# Altium schematic sheet Main heet.SchDoc
size 420 x 297 mm; Address1: Address1; Address2: Address2; Address3: Address3; Address4: Address4; DocumentNumber: АБВГ.123456.001 Э3; SheetNumber: 1; Scale: 1:1; DocumentType: Схема электрическая принципиальная; FirstReferrence: АБВГ.123456.001
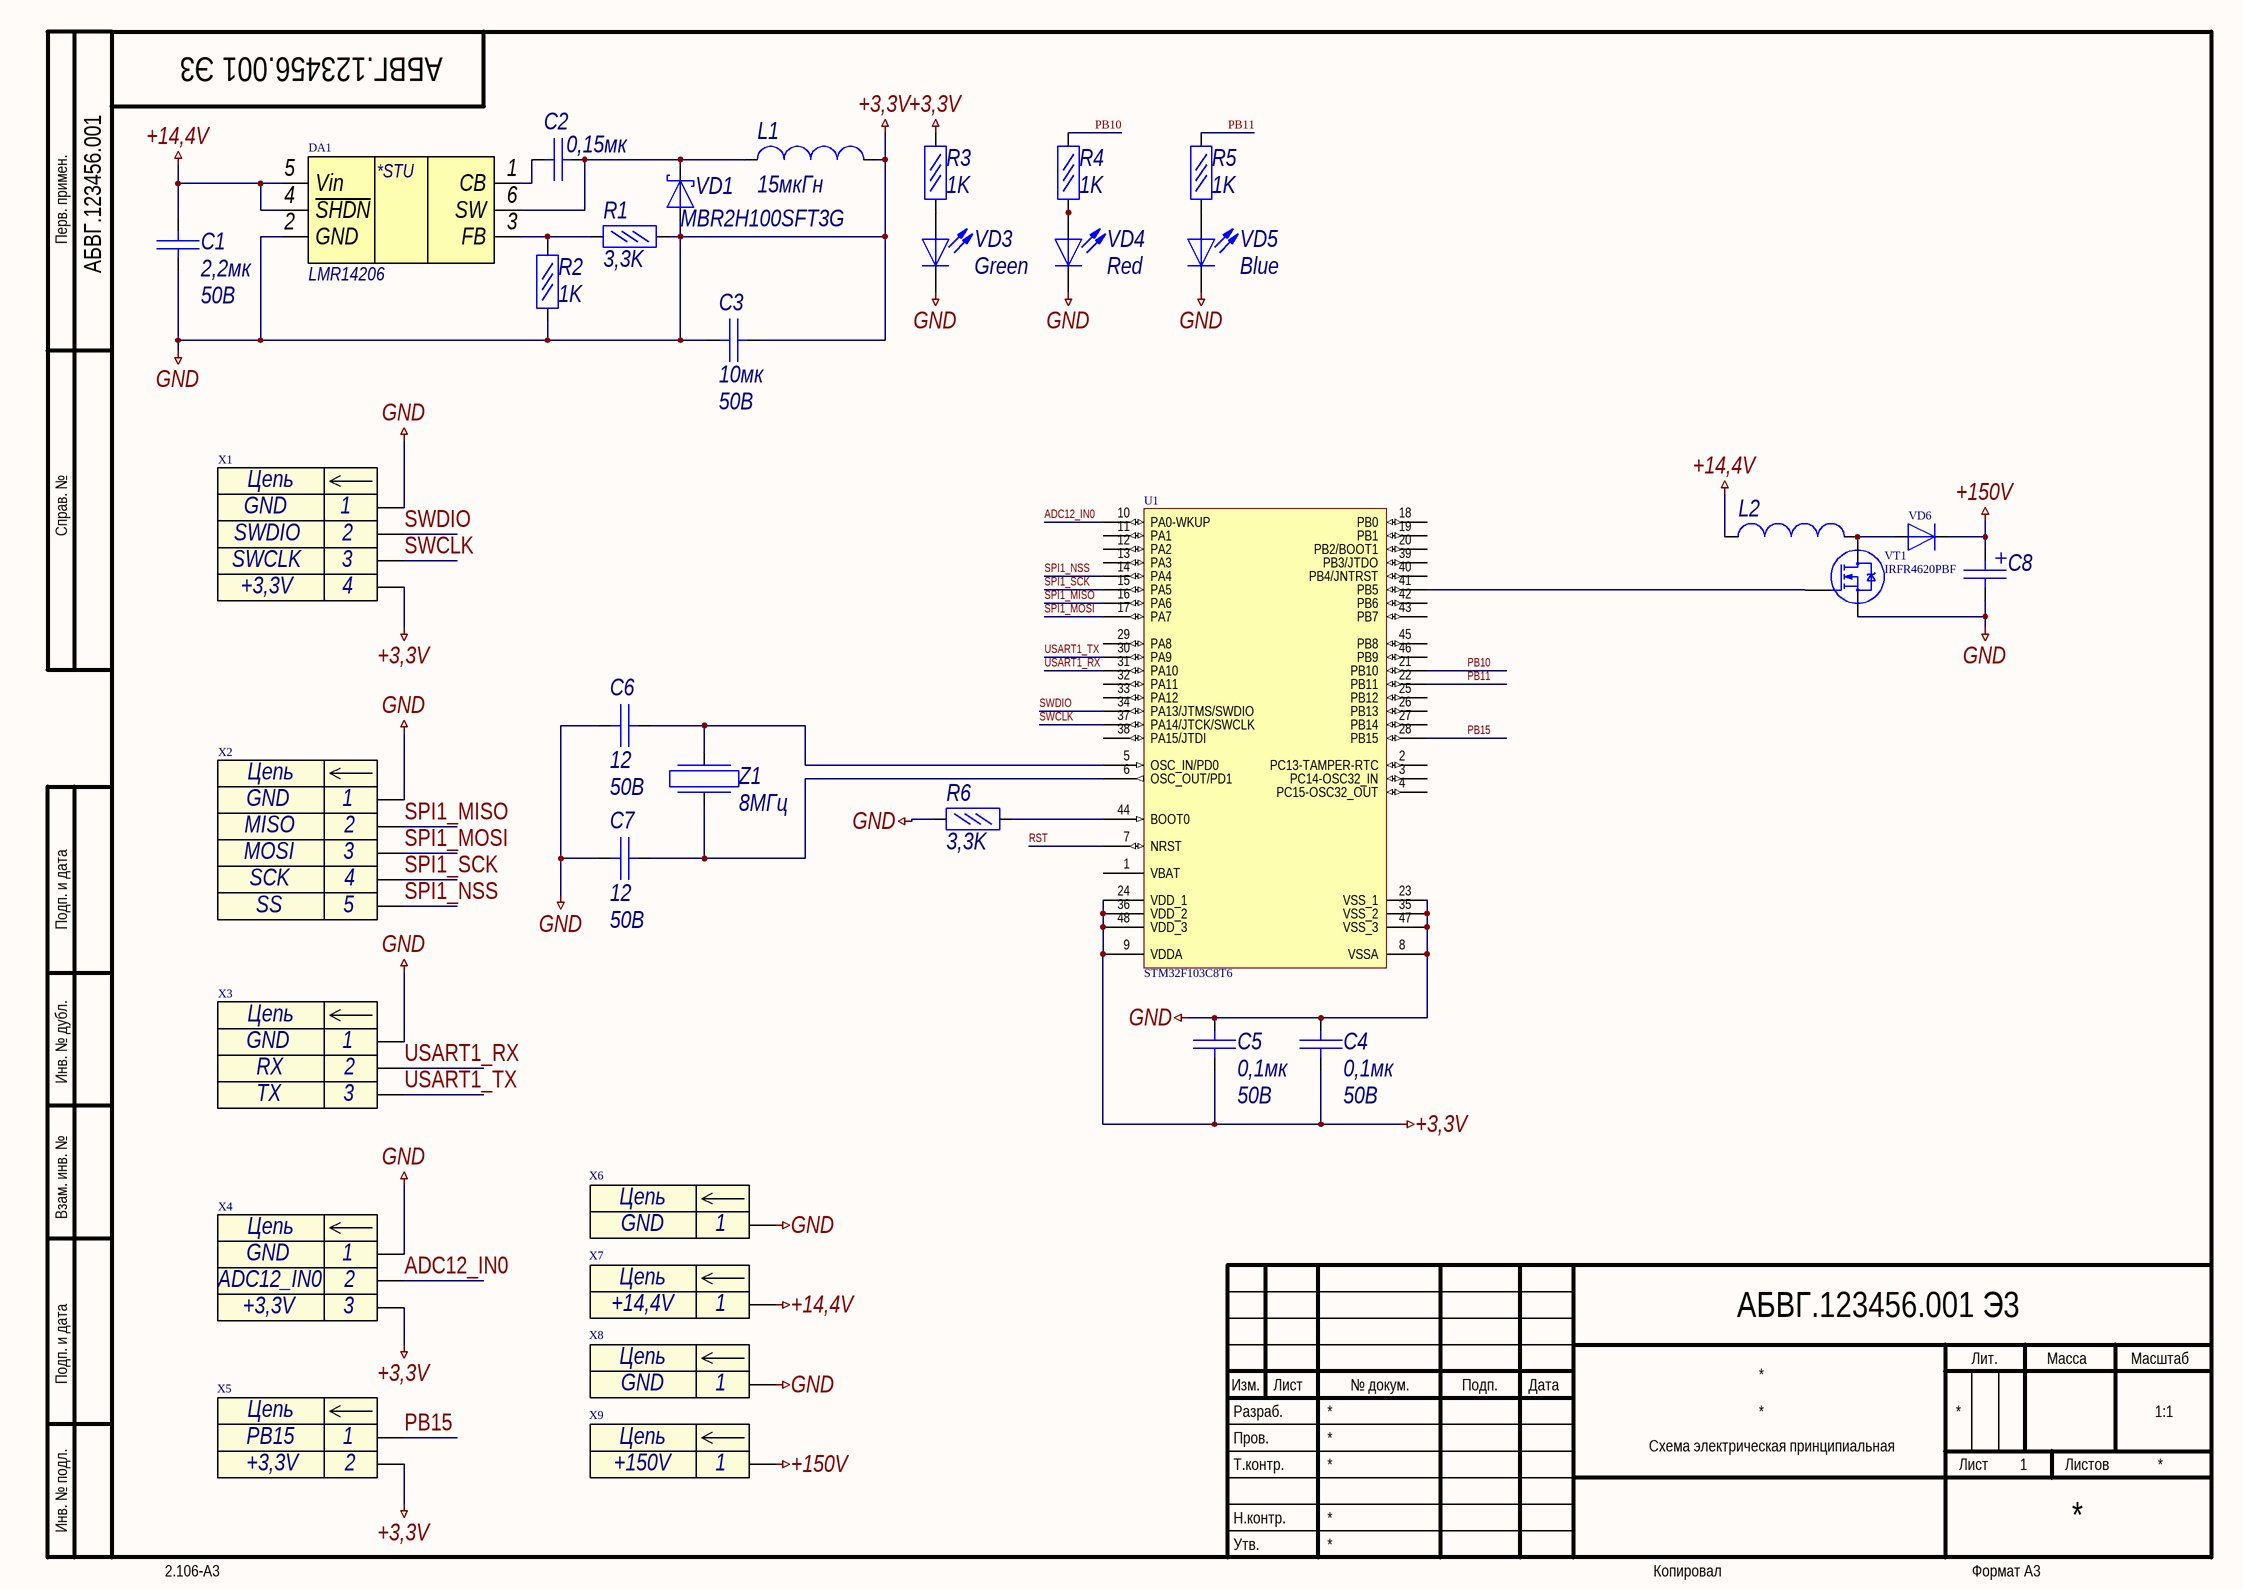
[diagram p0: Main heet.SchDoc]

## Parts
C1  Voltage: 50В  [NPC0805]  (hidden comment: 2,2мк)
C2  0,15мк  [NPC0805]
C3  Voltage: 50В  [NPC0805]  (hidden comment: 10мк)
C4  Voltage: 50В  [NPC0805]  (hidden comment: 0,1мк)
C5  Voltage: 50В  [NPC0805]  (hidden comment: 0,1мк)
C6  Voltage: 50В  [NPC0805]  (hidden comment: 12)
C7  Voltage: 50В  [NPC0805]  (hidden comment: 12)
C8  (no value)  [CAP_PIN_RAD_D16_A7.5]
DA1  LMR14206  [SOT23-6]
L1  15мкГн  [IND: B82472G]
L2  (no value)  [IND: B82477G]
R1  3,3K  [R0603]
R2  1K  [R0603]
R3  1K  [R0603]
R4  1K  [R0603]
R5  1K  [R0603]
R6  3,3K  [R0603]
U1  STM32F103C8T6  [LQFP48]
VD1  MBR2H100SFT3G  [SOD123]
VD3  Green  [0603_LED _GREEN]
VD4  Red  [0603_LED _RED]
VD5  Blue  [0603_LED_BLUE]
VD6  *  [DO-214AA]  (value not drawn)
VT1  IRFR4620PBF  [DPAK]
X1  (no value)  [PLS-4]
X2  (no value)  [PLS-5]
X3  (no value)  [PLS-3]
X4  (no value)  [PLS-3]
X5  (no value)  [PLS-2]
X6  (no value)  [Pad]
X7  (no value)  [Pad]
X8  (no value)  [Pad]
X9  (no value)  [Pad]
Z1  8МГц  [QUARTZ]

## Nets
+3,3V: C1.2 C3.1 C3.2 C4.1 C4.2 C5.1 C5.2 C6.2 C7.2 C8.2 DA1.2(GND) L1.2 R1.1 R2.2 R3.1 R6.2 U1.8(VSSA) U1.9(VDDA) U1.23(VSS_1) U1.24(VDD_1) U1.35(VSS_2) U1.36(VDD_2) U1.47(VSS_3) U1.48(VDD_3) VD1.2(A) VD3.1(K) VD4.1(K) VD5.1(K) VT1.S X1.1 X1.4 X2.1 X3.1 X4.1 X4.3 X5.2 X6.1 X8.1  [also labelled GND]
+14,4V: C1.1 DA1.4(~{SHDN}) DA1.5(Vin) L2.1 X7.1
+150V: C8.1 VD6.1(K) X9.1
ADC12_IN0: U1.10(PA0-WKUP) X4.2
PB10: R4.1 U1.21(PB10)
PB11: R5.1 U1.22(PB11)
PB15: U1.28(PB15) X5.1
RST: U1.7(NRST)
SPI1_MISO: U1.16(PA6) X2.2
SPI1_MOSI: U1.17(PA7) X2.3
SPI1_NSS: U1.14(PA4) X2.5
SPI1_SCK: U1.15(PA5) X2.4
SWCLK: U1.37(PA14/JTCK/SWCLK) X1.3
SWDIO: U1.34(PA13/JTMS/SWDIO) X1.2
USART1_RX: U1.31(PA10) X3.2
USART1_TX: U1.30(PA9) X3.3
NetC2_1: C2.1 DA1.1(CB)
NetC2_2: C2.2 DA1.6(SW) L1.1 VD1.1(K)
NetC6_1: C6.1 U1.5(OSC_IN/PD0) Z1.1
NetC7_1: C7.1 U1.6(OSC_OUT/PD1) Z1.2
NetDA1_3: DA1.3(FB) R1.2 R2.1
NetL2_2: L2.2 VD6.2(A) VT1.D
NetR3_2: R3.2 VD3.2(A)
NetR4_2: R4.2 VD4.2(A)
NetR5_2: R5.2 VD5.2(A)
NetR6_1: R6.1 U1.44(BOOT0)
NetU1_41: U1.41(PB5) VT1.G

Not connected (* = marked no-connect by the designer): U1 1(VBAT) 2(PC13-TAMPER-RTC) 3(PC14-OSC32_IN) 4(PC15-OSC32_OUT) 11(PA1) 12(PA2) 13(PA3) 18(PB0) 19(PB1) 20(PB2/BOOT1) 25(PB12) 26(PB13) 27(PB14) 29(PA8) 32(PA11) 33(PA12) 38(PA15/JTDI) 39(PB3/JTDO) 40(PB4/JNTRST) 42(PB6) 43(PB7) 45(PB8) 46(PB9)

## Notes on the sheet
- Перв. примен.
- Справ. №
- Подп. и дата
- Инв. № дубл.
- Взам. инв. №
- Разраб.
- Изм.
- Лист
- № докум.
- Подп.
- Дата
- Лит.
- Масса
- Масштаб
- Пров.
- Т.контр.
- Листов
- Инв. № подл.
- Утв.
- Н.контр.
- 2.106-A3
- Копировал
- Формат А3
- (in symbol Header_1_plg) Цепь
- (in symbol Header_2_plg) Цепь
- (in symbol Header_3_plg) Цепь
- (in symbol Header_4_plg) Цепь
- (in symbol Header_5_plg) Цепь
- (in symbol LMR14206) *STU

## Library data of the parts
C1 = Capacitor ceramic: Конденсатор кер.; Manufacturer: Yageo; Name: CC0805KKX5R9BB225; Value: 2,2мк; Package: 0805
C2 = Capacitor ceramic: Конденсатор кер.; Manufacturer: Yageo; Name: CC0805KRX7R9BB124; Package: 0805; Value: 0,15мк
C3 = Capacitor ceramic: Конденсатор кер.; Manufacturer: Yageo; Name: CC0805KKX5R8BB106; Value: 10мк; Package: 0805
C4 C5 = Capacitor ceramic: Конденсатор кер.; Manufacturer: Yageo; Name: CC0805JRX7R9BB104; Package: 0805; Value: 0,1мк
C6 C7 = Capacitor ceramic: Конденсатор кер.; Manufacturer: Yageo; Name: CC0805FRNPO9BN120; Package: 0805; Value: 12
C8 = Capacitor electrolytic: Конденсатор пол.
DA1 = LMR14206: DC\DC; Name: LMR14206
L1 = Inductor: Катушка индуктивности; Manufacturer: Epcos; Name: B82477G4153M; Package: B82472G; Value: 15мкГн
L2 = Inductor: Катушка индуктивности
R1 R6 = Резистор  0,05Вт: Резистор 0,05Вт; Manufacturer: Yageo; Name: RC0603FR-073K3L; Power rating: 0,05Вт; Package: 0603; Value: 3,3K
R2-R5 = Резистор  0,05Вт: Резистор 0,05Вт; Manufacturer: Yageo; Name: RC0603FR-071KL; Power rating: 0,05Вт; Package: 0603; Value: 1K
U1 = STM32F103C8T6: STM32 ARM-based 32-bit MCU with 64 Kbytes Flash, 48-pin LQFP, Industrial Temperature; Published: 30-May-2008; DatasheetVersion: rev6, Mar-2008; PackageVersion: Mar-2008; PackageReference: LQFP48; Publisher: Altium Limited; PackageDescription: 48-Pin Low-Profile Quad Flat Pack, 7 x 7 mm Body, 0.5 mm Pitch (LQFP48); ComponentLink1Description: Manufacturer Link; ComponentLink1URL: www.st.com/stm32; ComponentLink2Description: Datasheet; ComponentLink2URL: http://www.st.com/stonline/products/literature/ds/13587.pdf
VD1 = DiodeSchottky: Диод Шоттки; Manufacturer: ON Semiconductor; Vr: 100В; Vf: 840мВ @ 2А; Imax: 2А; Name: MBR2H100SFT3G; Package: SOD123_FL
VD3-VD5 = LED: Светодиод SMD; Manufacturer: KGB; Forward voltage; 25мА: 2,15В; Max. forward current (continuous): 25мА; Package: 0603
  VD3: Color: Green
  VD4: Color: Red
  VD5: Color: Blue
VD6 = Diode: Диод; Imax: *; Name: *; Vr: *; Vf: *
VT1 = IRFR4620PBF: N-канальный транзистор; Manufacturer: International Rectifier; Max. drain current (continuous); 25C: 24 A; Max. power dissipation; 25C: 144 w; Max. voltage drain-to-source: 150 V; Max. voltage gate-to-source: ±20 V; Resistance of open channel; 10В: 72 mohm; Total gate charge: 25 nC; Name: IRFR4620PBF; Package: DPAK
X1 = Header_4_plg: Разъем - 4 конт. вилка; Contact_1: GND; Contact_2: SWDIO; Contact_3: SWCLK; Contact_4: +3,3V
X2 = Header_5_plg: Разъем - 5 конт. вилка; Contact_1: GND; Contact_2: MISO; Contact_3: MOSI; Contact_4: SCK; Contact_5: SS
X3 = Header_3_plg: Разъем - 3 конт. вилка; Contact_1: GND; Contact_2: RX; Contact_3: TX
X4 = Header_3_plg: Разъем - 3 конт. вилка; Contact_1: GND; Contact_2: ADC12_IN0; Contact_3: +3,3V
X5 = Header_2_plg: Разъем - 2 конт. вилка; Contact_1: PB15; Contact_2: +3,3V
X6 X8 = Header_1_plg: Разъем - 1 конт. вилка; Contact_1: GND
X7 = Header_1_plg: Разъем - 1 конт. вилка; Contact_1: +14,4V
X9 = Header_1_plg: Разъем - 1 конт. вилка; Contact_1: +150V
Z1 = KX-7T 12.0: Кварцевый резонатор; Manufacturer: Geyer Electronics; Tolerance: 30ppm; Temperature tolerance: 100ppm; Load capacity: 12пФ; Max. aging frequency at first year: +-2ppm; Name: KX-7T 12.0; Temperature range: -40...85C; Value: 8МГц; Package: SMD3,2x2,5x0,8